# Altium schematic sheet LAUNCHXL-F28377S_2.SchDoc
size 301 x 237 mm
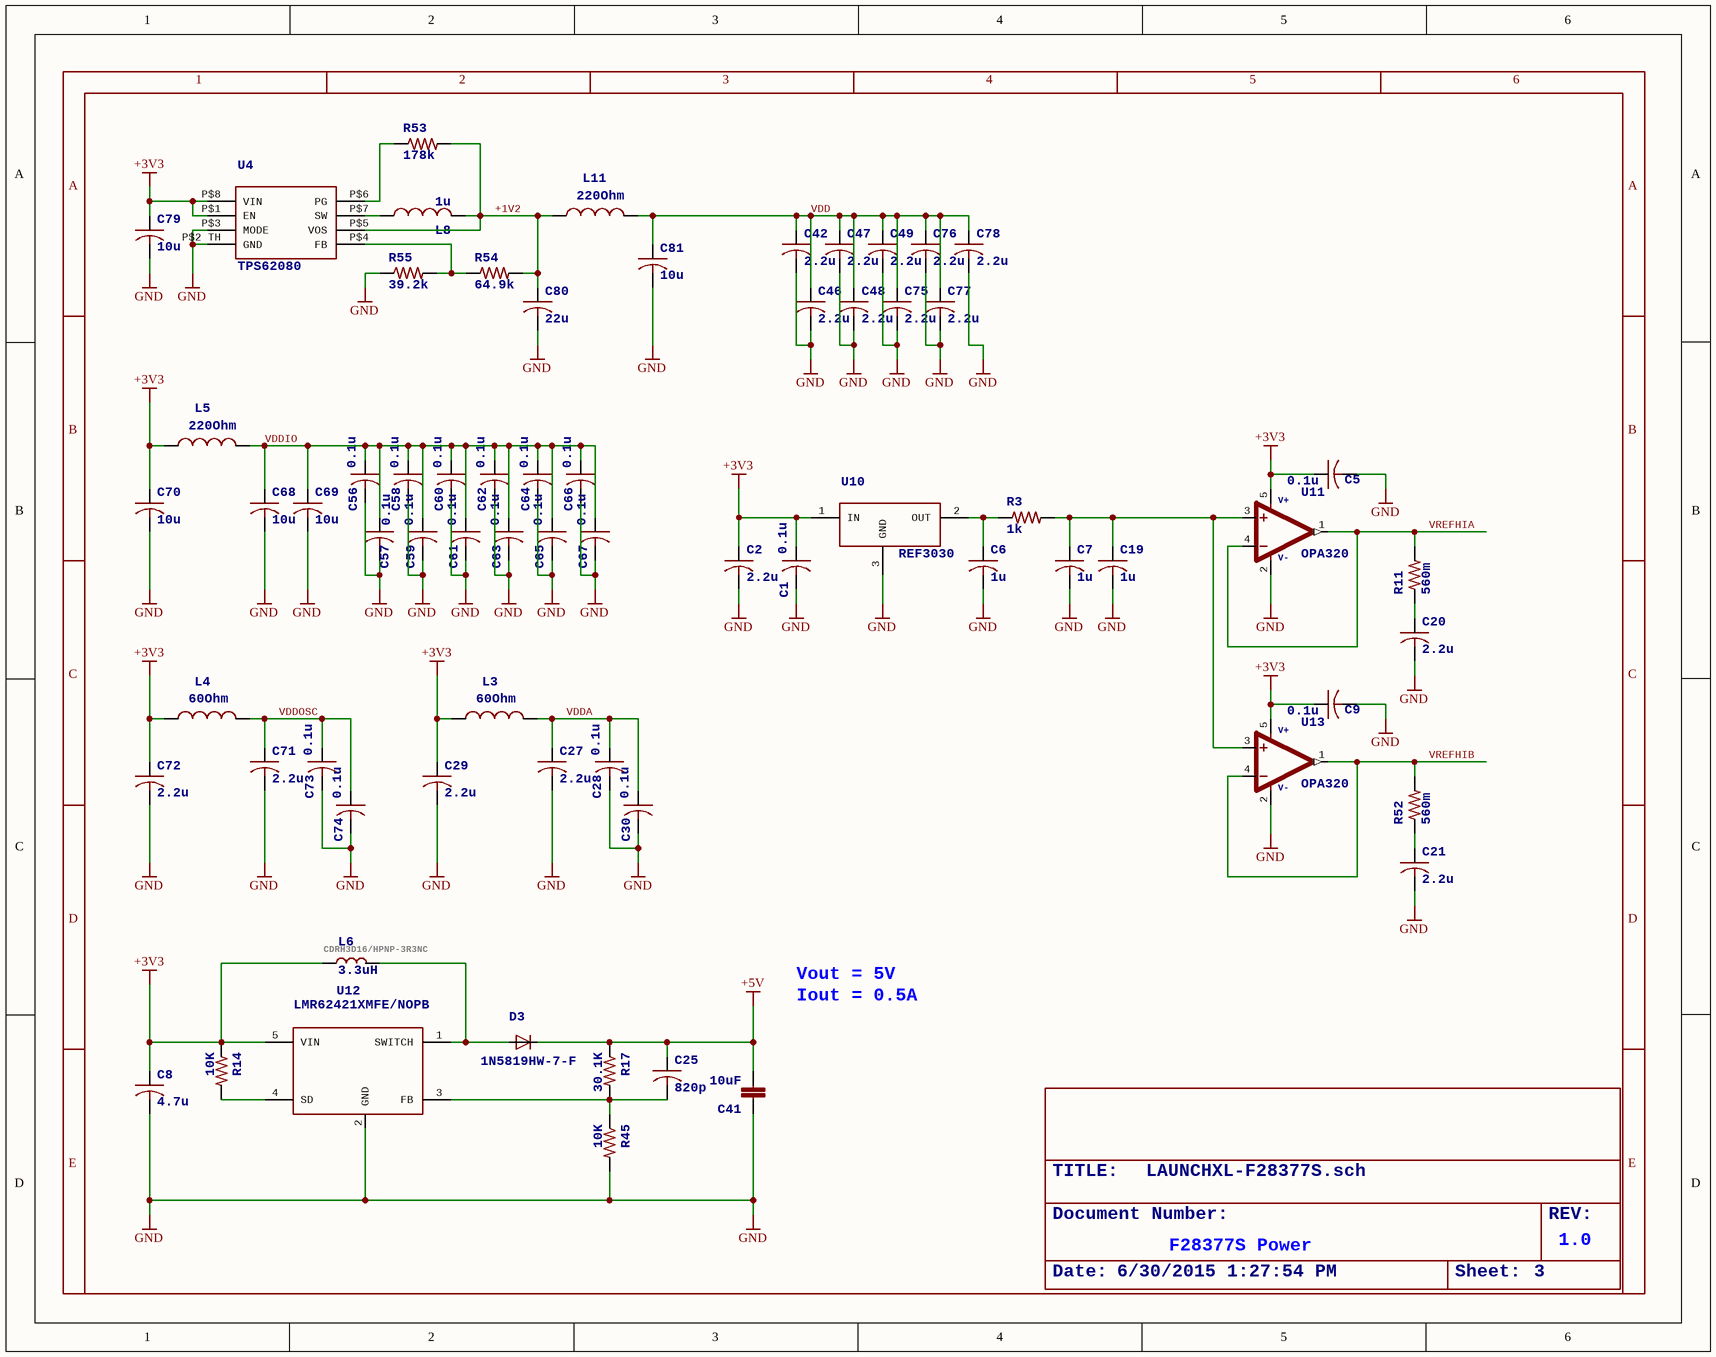
[diagram p0: LAUNCHXL-F28377S_2.SchDoc]

## Parts
C1  0.1u  [C0402]
C2  2.2u  [C0402]
C5  0.1u  [C0402]
C6  1u  [C0402]
C7  1u  [C0402]
C8  4.7u  [C0402]
C9  0.1u  [C0402]
C19  1u  [C0402]
C20  2.2u  [C0402]
C21  2.2u  [C0402]
C25  820p  [C0402]
C27  2.2u  [C0402]
C28  0.1u  [C0402]
C29  2.2u  [C0402]
C30  0.1u  [C0402]
C41  10uF  [SPARKFUN_1210]
C42  2.2u  [C0402]
C46  2.2u  [C0402]
C47  2.2u  [C0402]
C48  2.2u  [C0402]
C49  2.2u  [C0402]
C56  0.1u  [C0402]
C57  0.1u  [C0402]
C58  0.1u  [C0402]
C59  0.1u  [C0402]
C60  0.1u  [C0402]
C61  0.1u  [C0402]
C62  0.1u  [C0402]
C63  0.1u  [C0402]
C64  0.1u  [C0402]
C65  0.1u  [C0402]
C66  0.1u  [C0402]
C67  0.1u  [C0402]
C68  10u  [C0603]
C69  10u  [C0603]
C70  10u  [C0603]
C71  2.2u  [C0402]
C72  2.2u  [C0402]
C73  0.1u  [C0402]
C74  0.1u  [C0402]
C75  2.2u  [C0402]
C76  2.2u  [C0402]
C77  2.2u  [C0402]
C78  2.2u  [C0402]
C79  10u  [C0603]
C80  22u  [C0603]
C81  10u  [C0603]
D3  1N5819HW-7-F  [SOD123]
FRAME8  >LAST_DATE_TIME: 6/30/2015 1:27:54 PM  >SHEET: 3  >DRAWING_NAME: LAUNCHXL-F28377S.sch  (hidden comment: FRAME_A_L)
L3  60Ohm  [R0402]
L4  60Ohm  [R0402]
L5  220Ohm  [R0402]
L6  3.3uH  [INDUCT-3_7*3_5]
L8  1u  [L1212]
L11  220Ohm  [R0402]
R3  1k  [R0402]
R11  560m  [R0402]
R14  10K  [R0402]
R17  30.1K  [R0402]
R45  10K  [R0402]
R52  560m  [R0402]
R53  178k  [R0402]
R54  64.9k  [R0402]
R55  39.2k  [R0402]
U4  TPS62080  [SON8]
U10  REF3030  [DBZ_R-PDSO-G3]
U11  OPA320  [SOT23-5-DBV]
U12  LMR62421XMFE/NOPB  [SOT23-5-DBV]
U13  OPA320  [SOT23-5-DBV]

## Nets
+3V3: C1.1 C2.1 C5.1 C8.1 C9.1 C29.1 C70.1 C72.1 C79.1 L3.1 L4.1 L5.1 L6.P$1 R14.1 U4.P$1(EN) U4.P$8(VIN) U10.1(IN) U11.5(V+) U12.5(VIN) U13.5(V+)
+5V: C25.1 C41.2 D3.C R17.1
GND: C1.2 C2.2 C5.2 C6.2 C7.2 C8.2 C9.2 C19.2 C20.2 C21.2 C27.2 C28.2 C29.2 C30.2 C41.1 C42.2 C46.2 C47.2 C48.2 C49.2 C56.2 C57.2 C58.2 C59.2 C60.2 C61.2 C62.2 C63.2 C64.2 C65.2 C66.2 C67.2 C68.2 C69.2 C70.2 C71.2 C72.2 C73.2 C74.2 C75.2 C76.2 C77.2 C78.2 C79.2 C80.2 C81.2 R45.2 R55.1 U4.P$2_TH(GND) U4.P$3(MODE) U10.3(GND) U11.2(V-) U12.2(GND) U13.2(V-)
+1V2: C80.1 L8.P$2 L11.1 R53.2 R54.2 U4.P$5(VOS)
VDD: C42.1 C46.1 C47.1 C48.1 C49.1 C75.1 C76.1 C77.1 C78.1 C81.1 L11.2
VDDA: C27.1 C28.1 C30.1 L3.2
VDDIO: C56.1 C57.1 C58.1 C59.1 C60.1 C61.1 C62.1 C63.1 C64.1 C65.1 C66.1 C67.1 C68.1 C69.1 L5.2
VDDOSC: C71.1 C73.1 C74.1 L4.2
VREFHIA: R11.2 U11.1(OUT) U11.4(-IN)
VREFHIB: R52.2 U13.1(OUT) U13.4(-IN)
NetC6_1: C6.1 R3.1 U10.2(OUT)
NetC7_1: C7.1 C19.1 R3.2 U11.3(+IN) U13.3(+IN)
NetC20_1: C20.1 R11.1
NetC21_1: C21.1 R52.1
NetC25_2: C25.2 R17.2 R45.1 U12.3(FB)
NetD3_A: D3.A L6.P$2 U12.1(SWITCH)
NetL8_P$1: L8.P$1 U4.P$7(SW)
NetR14_2: R14.2 U12.4(SD)
NetR53_1: R53.1 U4.P$6(PG)
NetR54_1: R54.1 R55.2 U4.P$4(FB)

## Notes on the sheet
- (near L6) CDRH3D16/HPNP-3R3NC
- Vout = 5V
- Iout = 0.5A
- F28377S Power
- 1.0
- 1
- 2
- 3
- 4
- 5
- 6
- A
- B
- C
- D
- E

## Library data of the parts
C1 C2 C5-C9 C19-C21 C25 C27-C30 C42 C46-C49 C56-C67 C71-C78 = C-USC0402: <B>CAPACITOR</B>, American symbol
C41 = SPARKFUN_CAP1210: <b>Capacitor</b> / Standard 0603 ceramic capacitor, and 0.1" leaded capacitor.
C68-C70 C79-C81 = C-USC0603: <B>CAPACITOR</B>, American symbol
D3 = 1N4148: <B>DIODE</B><p> / high speed (Philips)
FRAME8 = FRAME_A_L: <b>FRAME</b> A Size , 8 1/2 x 11 INCH, Landscape<p>; Date:: Date:; Sheet:: Sheet:; REV:: REV:; TITLE:: TITLE:; Document Number:: Document Number:
L3-L5 L11 = L-US0402: <B>INDUCTOR</B>, American symbol
L6 = VLF4012A
L8 = L-USL1212: <B>INDUCTOR</B>, American symbol
R3 R11 R14 R17 R45 R52-R55 = R-US_R0402: <B>RESISTOR</B>, American symbol
U10 = REF30XX
U11 U13 = OPA320: V+: V+; V-: V-